# Altium schematic sheet CarrierBoardPPower.SchDoc
size A4; SheetNumber: 1; SheetTotal: 3
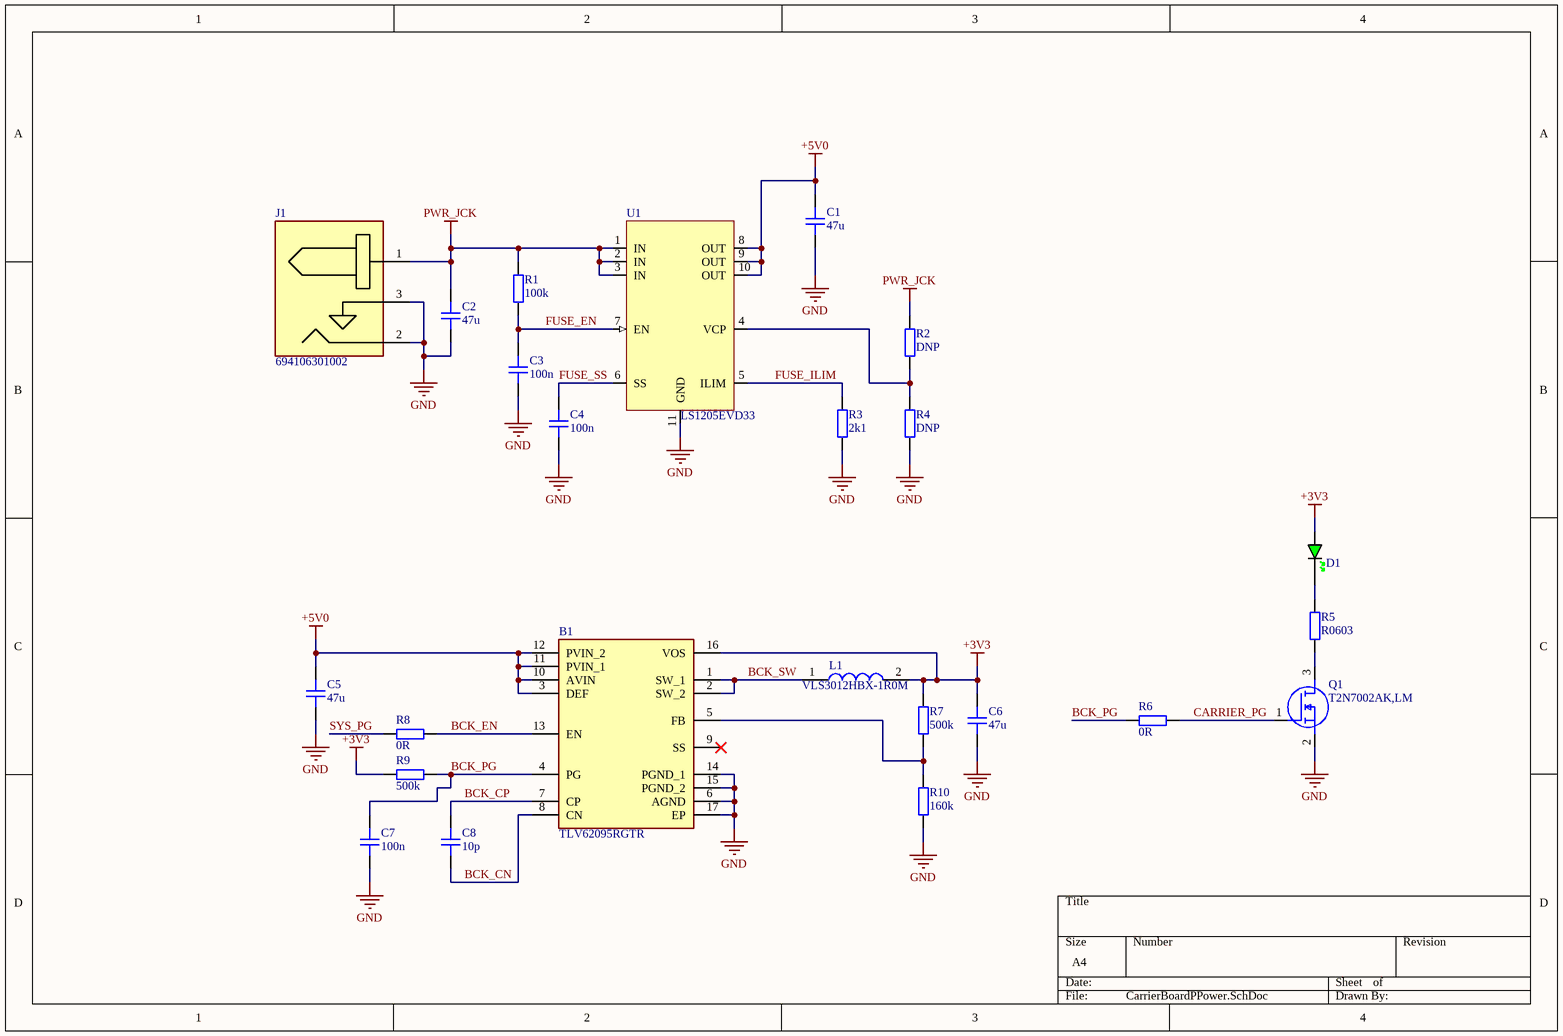
[diagram p0: CarrierBoardPPower.SchDoc]

## Parts
B1  TLV62095RGTR  [QFN50P300X300X100-17N-D]
C1  47u  [CAP_1210]
C2  47u  [CAP_1210]
C3  100n  [CAP_0402]
C4  100n  [CAP_0402]
C5  47u  [CAP_1210]
C6  47u  [CAP_1210]
C7  100n  [CAP_0402]
C8  10p  [CAP_0402]
D1  GREEN  [LED_0603_GREEN]  (value not drawn)
J1  694106301002  [694106301002_1]
L1  VLS3012HBX-1R0M  [VLS3012]
Q1  T2N7002AK,LM  [TBAT54CLM]
R1  100k  [RES_0603]
R2  DNP  [RES_0603]
R3  2k1  [RES_0402]
R4  DNP  [RES_0603]
R5  R0603  [RES_0603]
R6  0R  [RES_0402]
R7  500k  [RES_0402]
R8  0R  [RES_0402]
R9  500k  [RES_0402]
R10  160k  [RES_0402]
U1  LS1205EVD33  [DFN3x3_10L]

## Nets
+3V3: B1.16(VOS) C6.2 D1.A L1.2 R7.2 R9.2
+5V0: B1.3(DEF) B1.10(AVIN) B1.11(PVIN_1) B1.12(PVIN_2) C1.2 C5.2 U1.8(OUT) U1.9(OUT) U1.10(OUT)
GND: B1.6(AGND) B1.14(PGND_1) B1.15(PGND_2) B1.17(EP) C1.1 C2.1 C3.1 C4.1 C5.1 C6.1 C7.1 J1.2 J1.3 Q1.2(S) R3.1 R4.1 R10.1 U1.11(GND)
PWR_JCK: C2.2 J1.1 R1.2 R2.2 U1.1(IN) U1.2(IN) U1.3(IN)
BCK_CN: B1.8(CN) C8.1
BCK_CP: B1.7(CP) C8.2
BCK_EN: B1.13(EN) R8.1
BCK_PG: B1.4(PG) C7.2 R6.2 R9.1
BCK_SW: B1.1(SW_1) B1.2(SW_2) L1.1
CARRIER_PG: Q1.1(G) R6.1
FUSE_EN: C3.2 R1.1 U1.7(EN)
FUSE_ILIM: R3.2 U1.5(ILIM)
FUSE_SS: C4.2 U1.6(SS)
SYS_PG: R8.2
NetB1_5: B1.5(FB) R7.1 R10.2
NetD1_K: D1.K R5.2
NetQ1_3: Q1.3(D) R5.1
NetR2_1: R2.1 R4.2 U1.4(VCP)

Not connected (* = marked no-connect by the designer): B1 9(SS)*

## Library data of the parts
B1 = TLV62095RGTR: 4A Synchronous Step Down Converter with DCS Control; Manufacturer_Name: Texas Instruments; Geometry.Height: 1mm; Mouser Part Number: 595-TLV62095RGTR; Mouser Price/Stock: https://www.mouser.co.uk/ProductDetail/Texas-Instruments/TLV62095RGTR?qs=f4l5qYp%2Fy%252B5FMQoaGbkQ%252Bg%3D%3D; Manufacturer_Part_Number: TLV62095RGTR; Datasheet Link: http://www.ti.com/lit/gpn/TLV62095
C1 C2 C5 C6 = CAP_1210: Capacitor SMD 1210; Manufacturer: *; Manufacturer Part Number: *; Distributor Link: *; LCSC: *; Rating: *; Dielectric: *
C3 C4 C7 C8 = CAP_0402: Capacitor SMD 0402; Manufacturer: *; Manufacturer Part Number: *; Distributor Link: *; LCSC: *; Rating: *; Dielectric: *
D1 = LED_0603_GREEN: LED 0603 GREEN SMD
J1 = 694106301002: Connector; Manufacturer_Name: Wurth Elektronik; Datasheet Link: https://datasheet.datasheetarchive.com/originals/distributors/Datasheets_SAMA/1c153bd2ba42bb51bda59ee4cd9765cd.pdf; Manufacturer_Part_Number: 694106301002; Mouser Part Number: 710-694106301002; Mouser Price/Stock: https://www.mouser.co.uk/ProductDetail/Wurth-Elektronik/694106301002?qs=a9WhcLg8qCwOEkcI62k5mA%3D%3D
L1 = VLS3012HBX-1R0M: Inductor; Manufacturer_Name: TDK; Datasheet Link: https://product.tdk.com/system/files/dam/doc/product/inductor/inductor/smd/catalog/inductor_commercial_power_vls3012hbx_en.pdf; Manufacturer_Part_Number: VLS3012HBX-1R0M; Mouser Part Number: 810-VLS3012HBX-1R0M; Mouser Price/Stock: https://www.mouser.co.uk/ProductDetail/TDK/VLS3012HBX-1R0M?qs=pfd5qewlna4O71VRfcrI8g%3D%3D; Arrow Part Number: VLS3012HBX-1R0M; Arrow Price/Stock: https://www.arrow.com/en/products/vls3012hbx-1r0m/tdk?region=nac
Q1 = T2N7002AK,LM: MOSFET (N-Channel); Manufacturer_Name: Toshiba; Datasheet Link: http://toshiba.semicon-storage.com/info/docget.jsp?did=29712&prodName=T2N7002AK; Height: 1.1mm; Manufacturer_Part_Number: T2N7002AK,LM; Mouser Part Number: 757-T2N7002AKLM; Mouser Price/Stock: https://www.mouser.co.uk/ProductDetail/Toshiba/T2N7002AKLM?qs=pzVvXTvk9PzfX4hYglwZ9Q%3D%3D; Arrow Part Number: T2N7002AK,LM; Arrow Price/Stock: https://www.arrow.com/en/products/t2n7002aklm/toshiba?region=nac
R1 R2 R4 R5 = RES_0603: Resistor SMD 0603; Manufacturer: *; Manufacturer Part Number: *; Distributor Link: *; LCSC: *
R3 R6-R10 = RES_0402: Resistor SMD 0402; Manufacturer: *; Manufacturer Part Number: *; Distributor Link: *; LCSC: *
U1 = LS1205EVD33: 18V, 5A eFuse with Programmable Current Limit and Output Voltage Clamp; Manufacturer: Littelfuse; Manufacturer Part Number: LS1205EVD33